# Altium schematic sheet 0057_DISPLAY - DUT EDP .SchDoc
size 848 x 558 mm
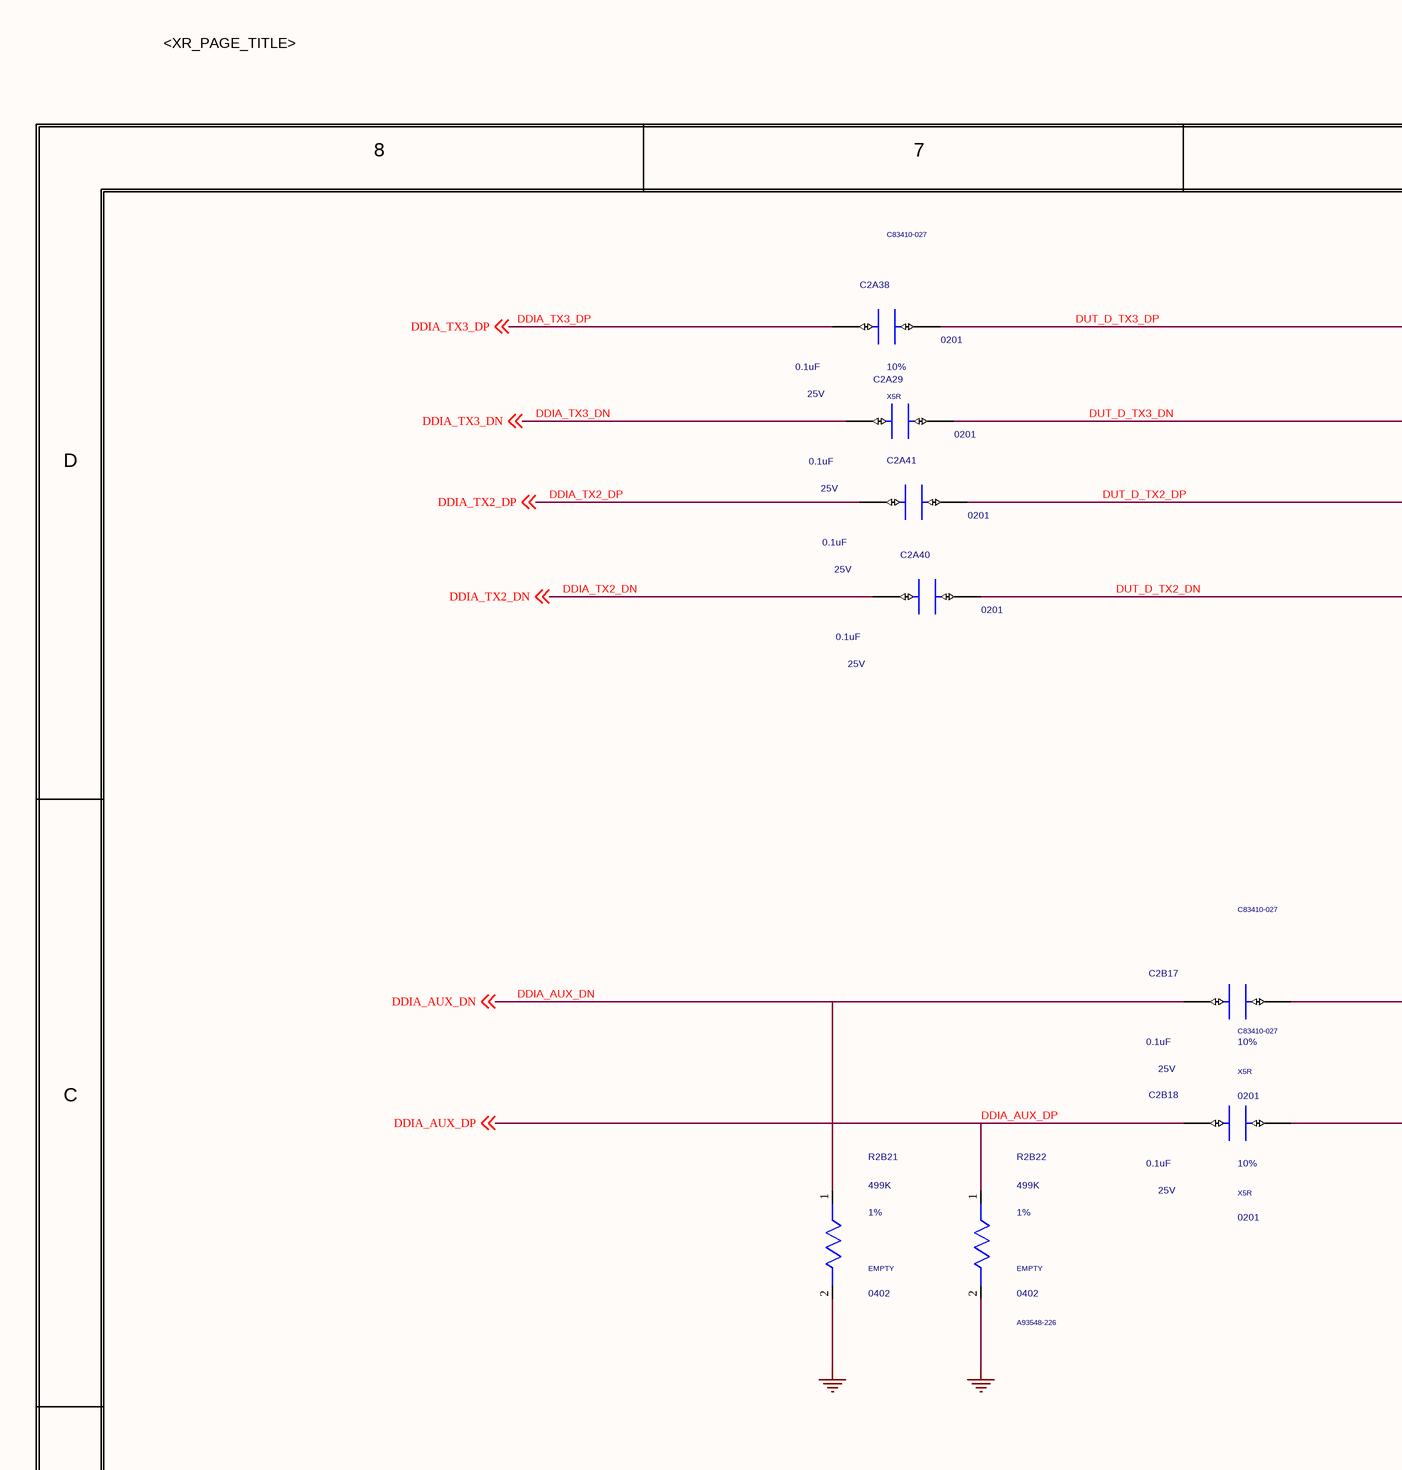
[diagram p0: 0057_DISPLAY - DUT EDP .SchDoc, top left]
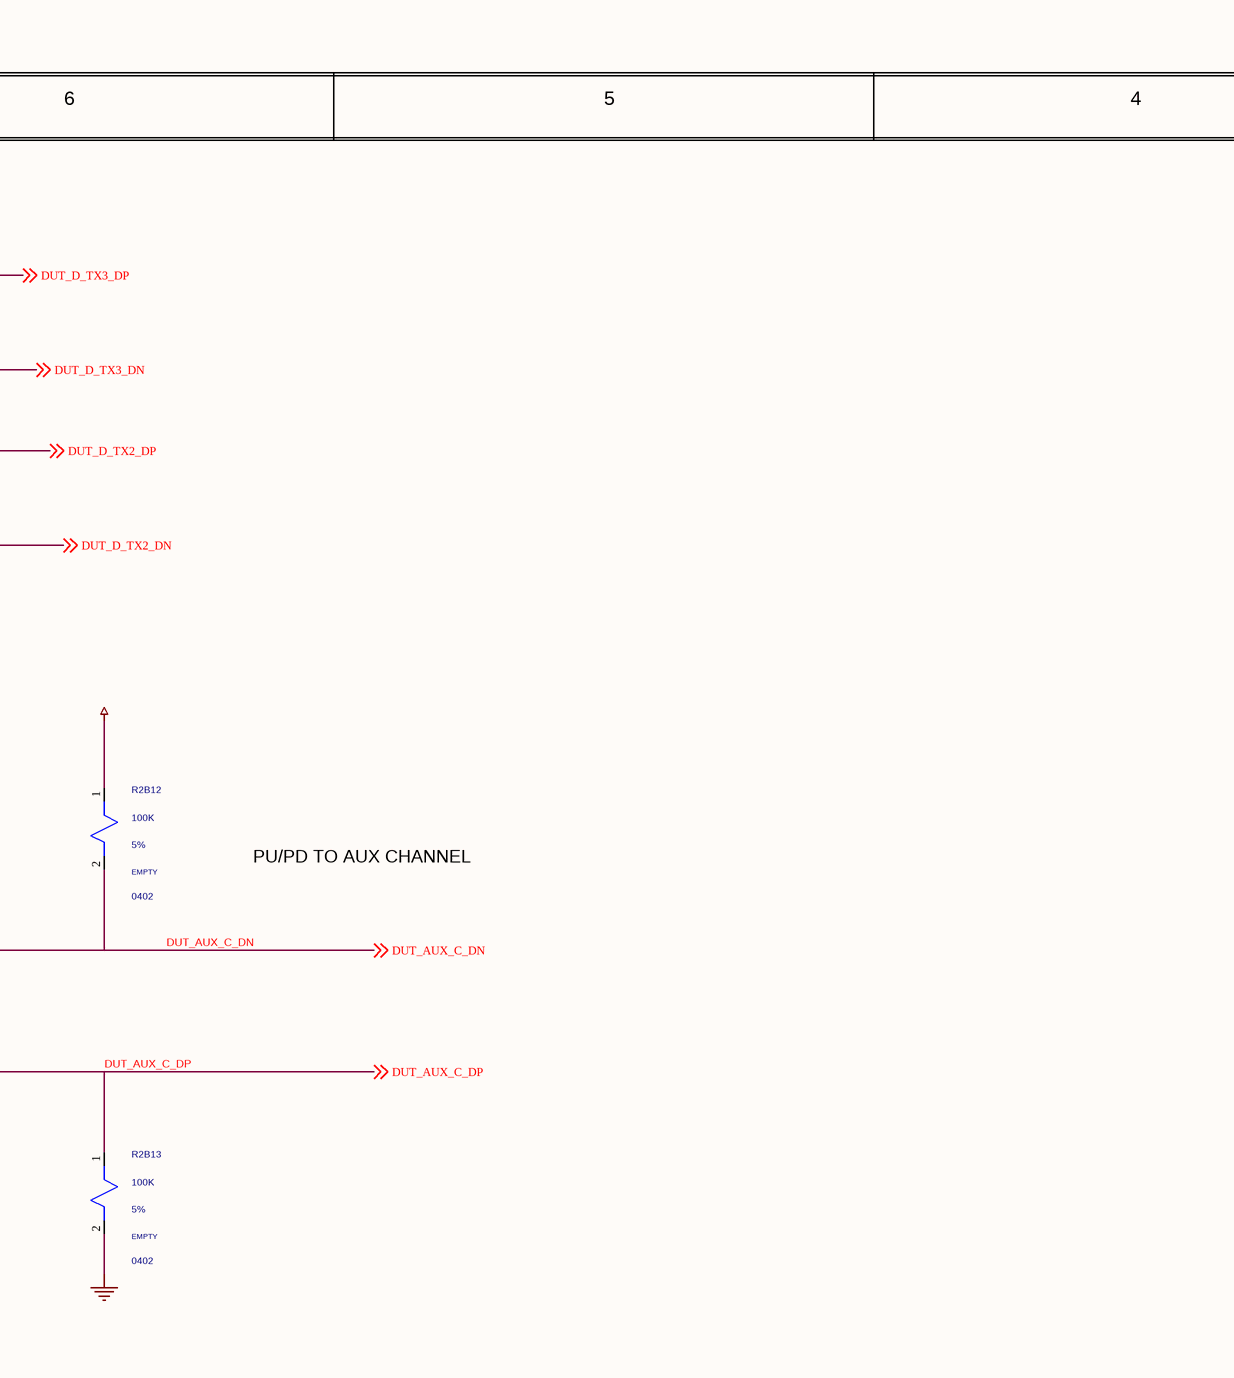
[diagram p1: 0057_DISPLAY - DUT EDP .SchDoc, top middle]
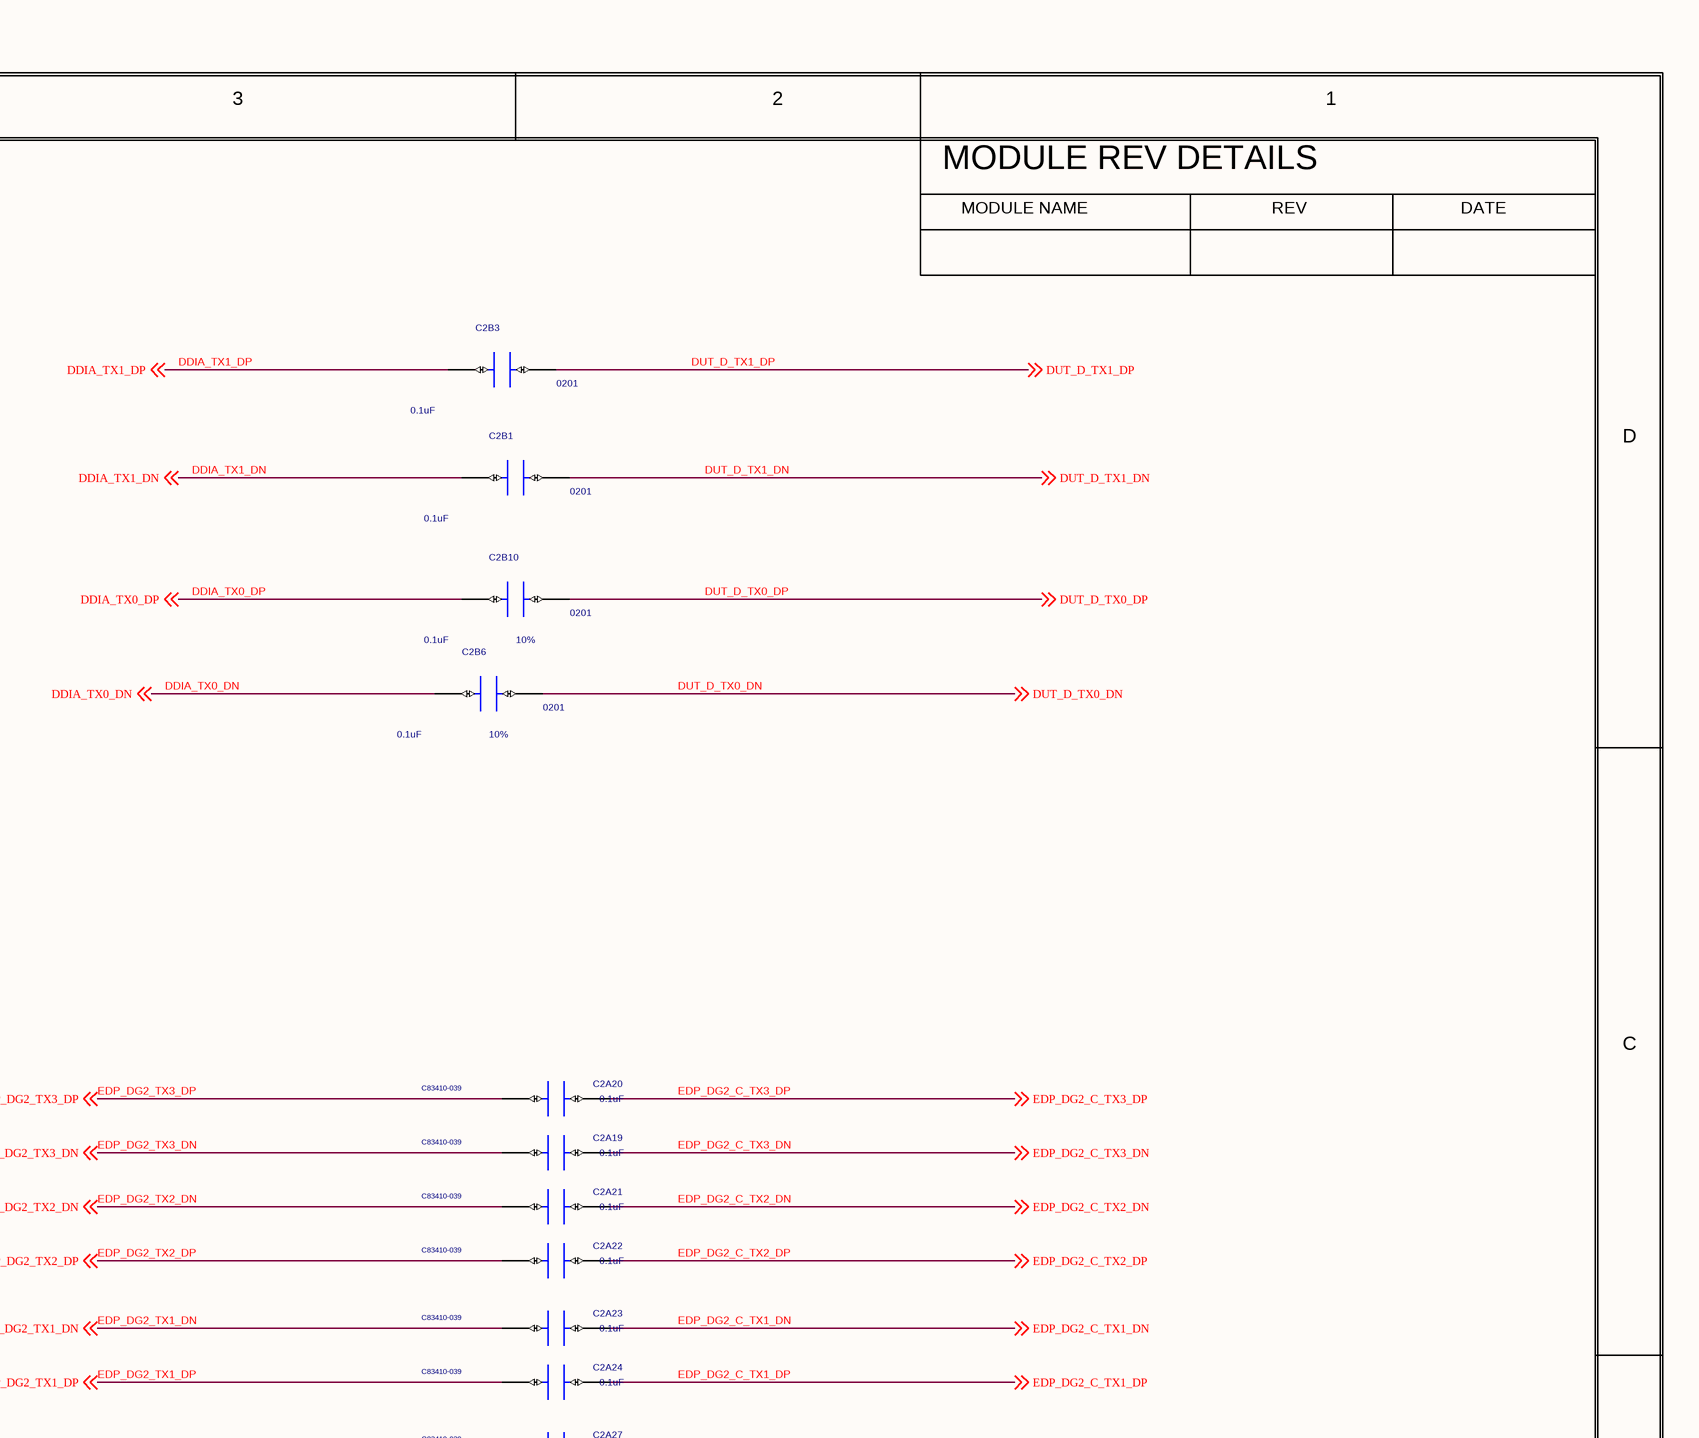
[diagram p2: 0057_DISPLAY - DUT EDP .SchDoc, top right]
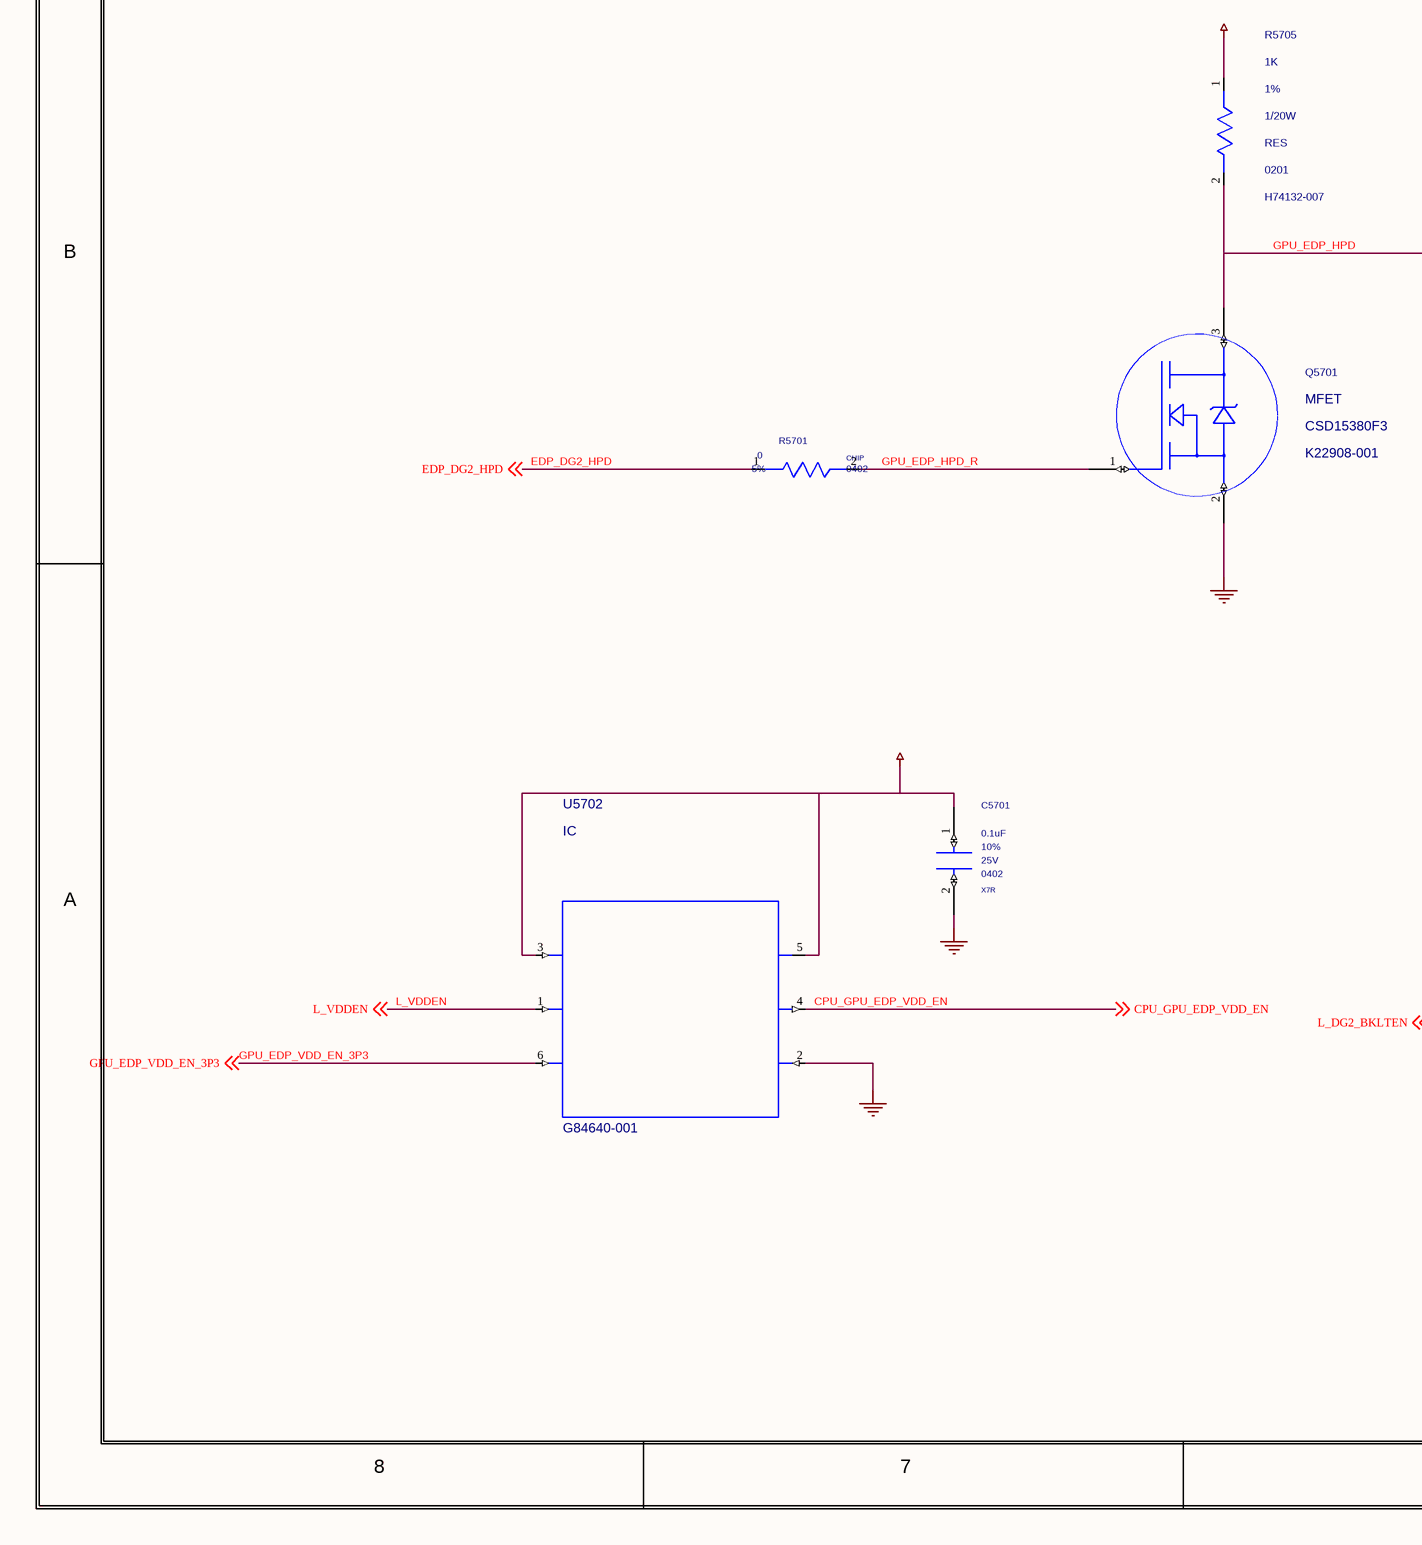
[diagram p3: 0057_DISPLAY - DUT EDP .SchDoc, bottom left]
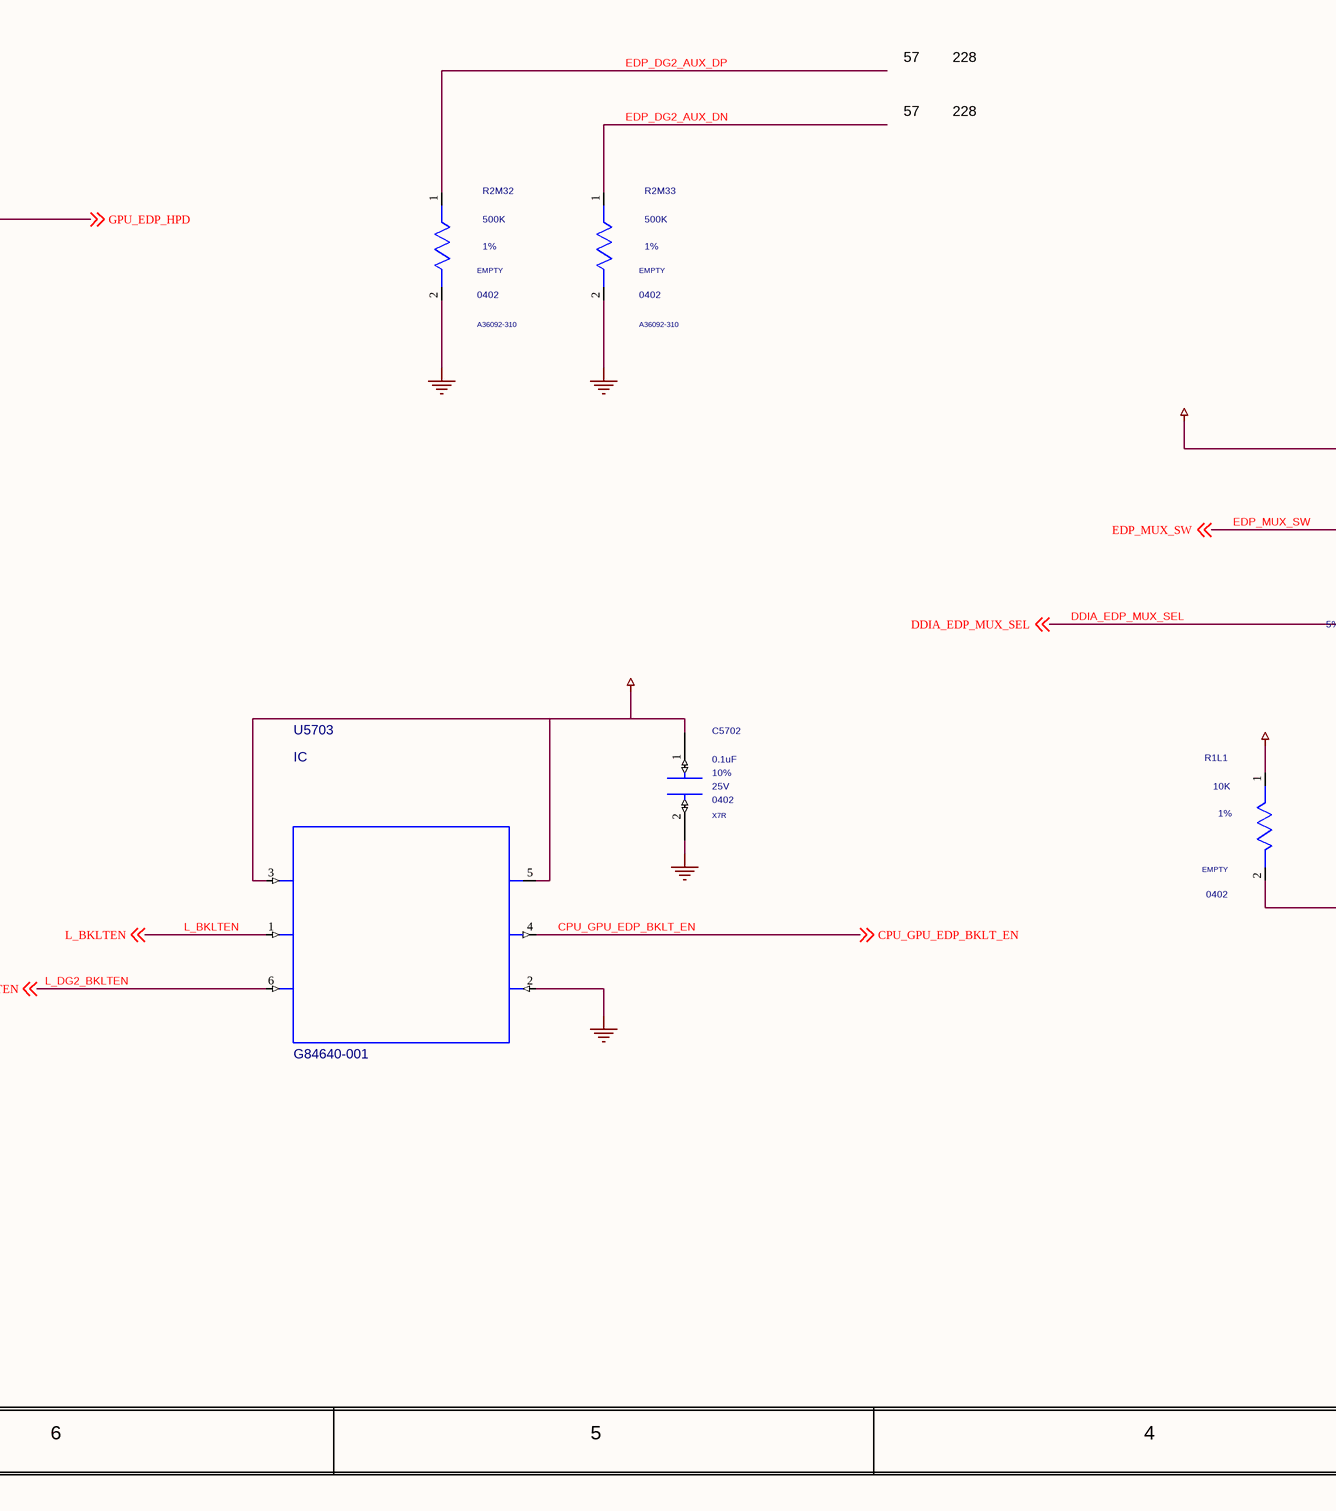
[diagram p4: 0057_DISPLAY - DUT EDP .SchDoc, bottom middle]
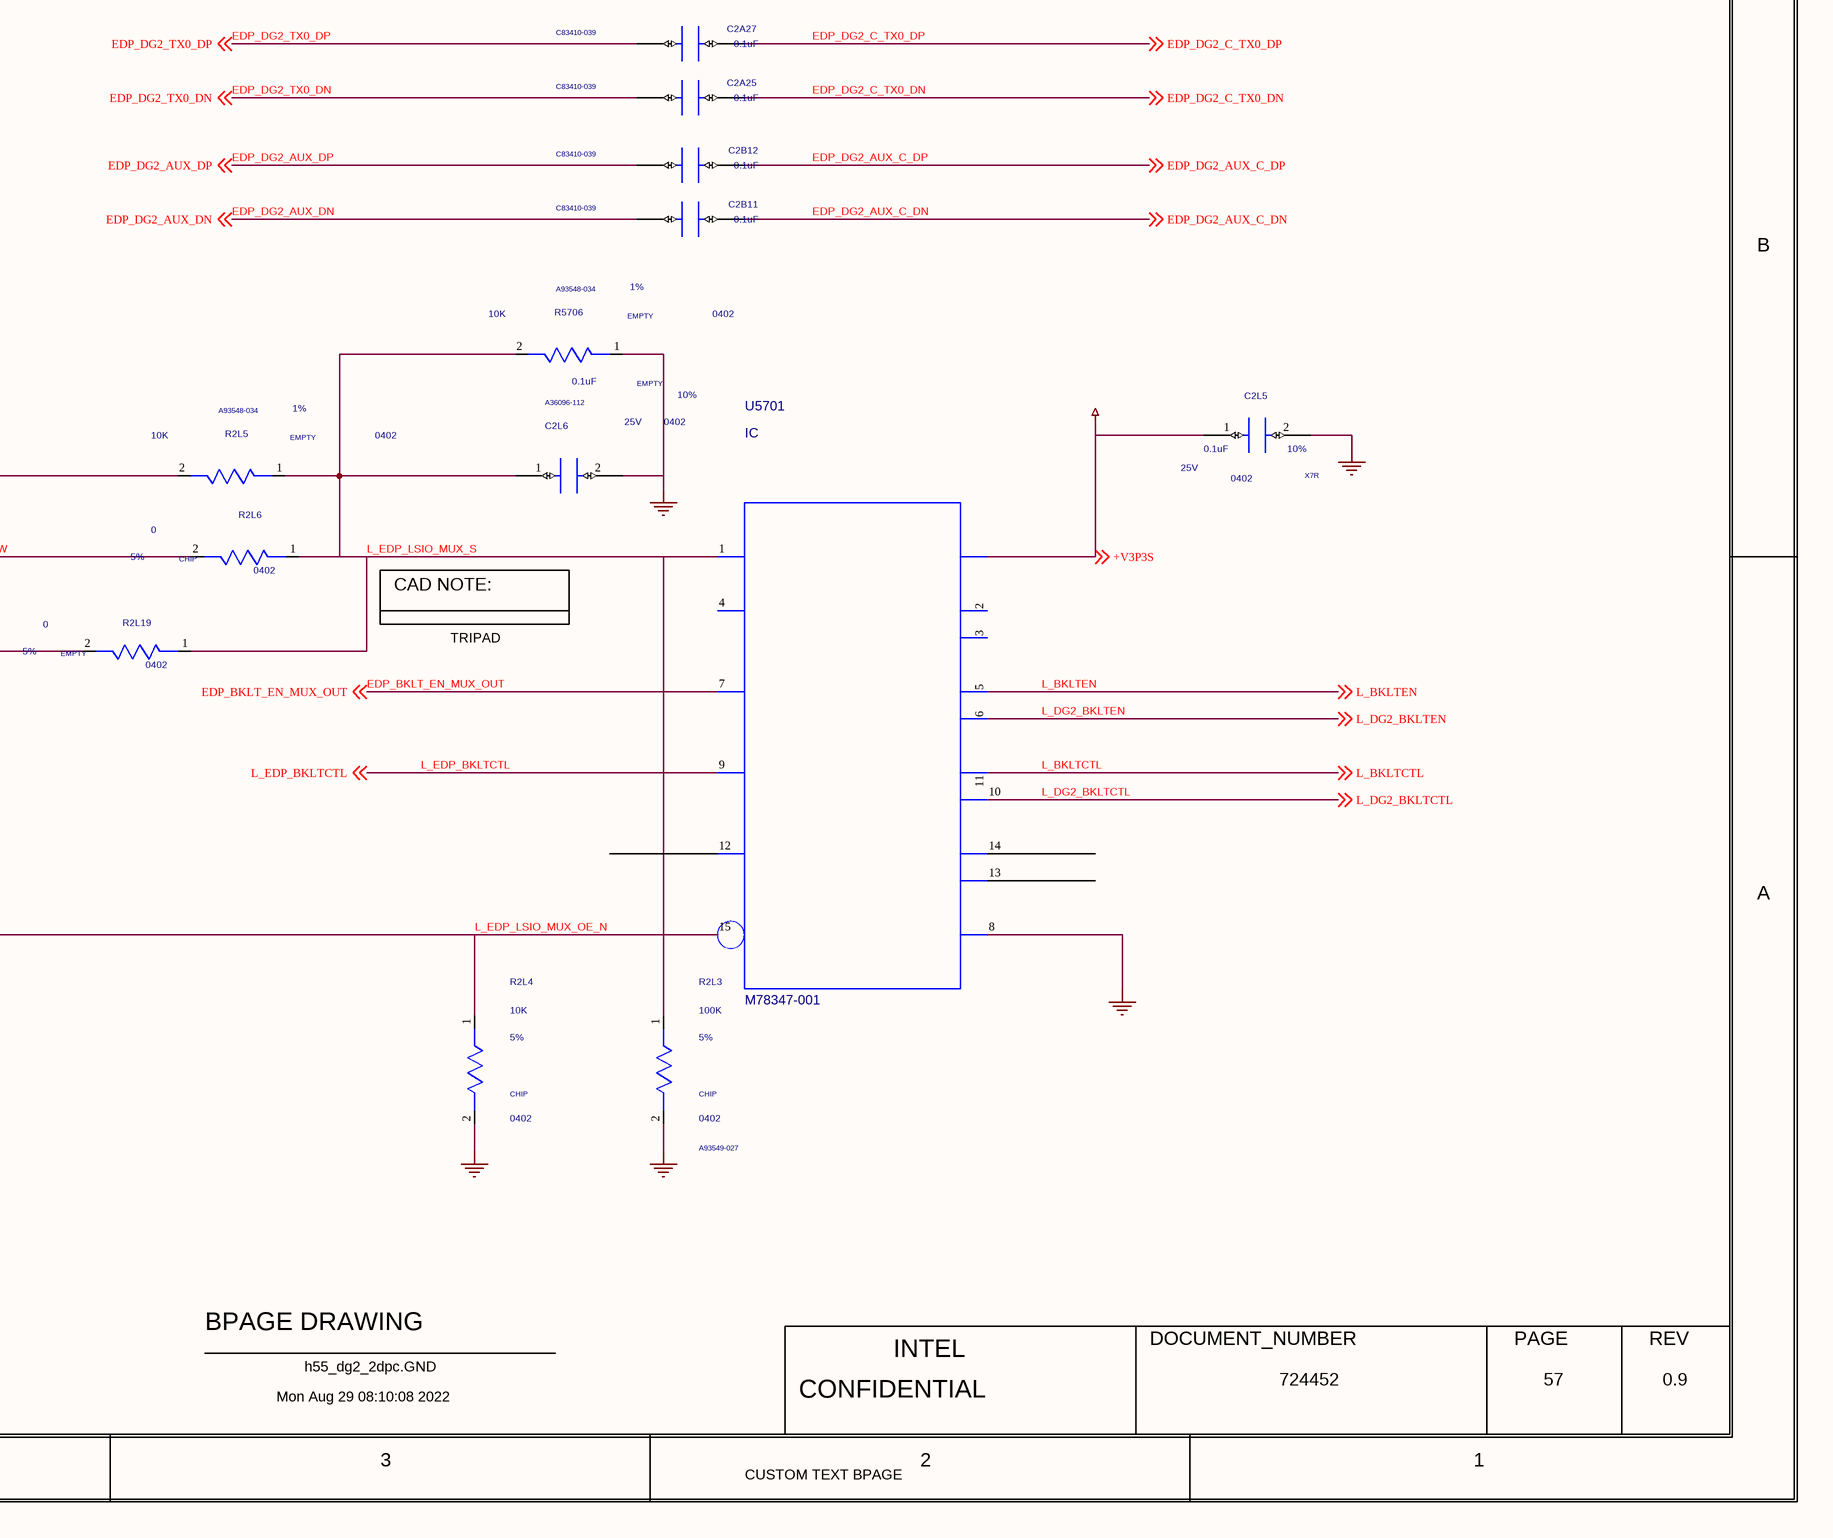
[diagram p5: 0057_DISPLAY - DUT EDP .SchDoc, bottom right]

## Parts
C2A19  0.1uF  PART_NUMBER: C83410-039  [CTK0_SM0201_630X330_MA]
C2A20  0.1uF  PART_NUMBER: C83410-039  [CTK0_SM0201_630X330_MA]
C2A21  0.1uF  PART_NUMBER: C83410-039  [CTK0_SM0201_630X330_MA]
C2A22  0.1uF  PART_NUMBER: C83410-039  [CTK0_SM0201_630X330_MA]
C2A23  0.1uF  PART_NUMBER: C83410-039  [CTK0_SM0201_630X330_MA]
C2A24  0.1uF  PART_NUMBER: C83410-039  [CTK0_SM0201_630X330_MA]
C2A25  0.1uF  PART_NUMBER: C83410-039  [CTK0_SM0201_630X330_MA]
C2A27  0.1uF  PART_NUMBER: C83410-039  [CTK0_SM0201_630X330_MA]
C2A29  0.1uF  PACK_TYPE: 0201  VOLTAGE: 25V  [CTK0_SM0201_650X350_MA]
C2A38  0.1uF  MATERIAL: X5R  PACK_TYPE: 0201  PART_NUMBER: C83410-027  TOLERANCE: 10%  VOLTAGE: 25V  [CTK0_SM0201_650X350_MA]
C2A40  0.1uF  PACK_TYPE: 0201  VOLTAGE: 25V  [CTK0_SM0201_650X350_MA]
C2A41  0.1uF  PACK_TYPE: 0201  VOLTAGE: 25V  [CTK0_SM0201_650X350_MA]
C2B1  0.1uF  PACK_TYPE: 0201  [CTK0_SM0201_650X350_MA]
C2B3  0.1uF  PACK_TYPE: 0201  [CTK0_SM0201_650X350_MA]
C2B6  0.1uF  PACK_TYPE: 0201  TOLERANCE: 10%  [CTK0_SM0201_650X350_MA]
C2B10  0.1uF  PACK_TYPE: 0201  TOLERANCE: 10%  [CTK0_SM0201_650X350_MA]
C2B11  0.1uF  PART_NUMBER: C83410-039  [CTK0_SM0201_630X330_MA]
C2B12  0.1uF  PART_NUMBER: C83410-039  [CTK0_SM0201_630X330_MA]
C2B17  0.1uF  MATERIAL: X5R  PACK_TYPE: 0201  PART_NUMBER: C83410-027  TOLERANCE: 10%  VOLTAGE: 25V  [CTK0_SM0201_650X350_MA]
C2B18  0.1uF  MATERIAL: X5R  PACK_TYPE: 0201  PART_NUMBER: C83410-027  TOLERANCE: 10%  VOLTAGE: 25V  [CTK0_SM0201_650X350_MA]
C2L5  0.1uF  MATERIAL: X7R  PACK_TYPE: 0402  TOLERANCE: 10%  VOLTAGE: 25V  [SMC0402IA]
C2L6  0.1uF  MATERIAL: EMPTY  PACK_TYPE: 0402  PART_NUMBER: A36096-112  TOLERANCE: 10%  VOLTAGE: 25V  [SMC0402IA]
C5701  0.1uF  MATERIAL: X7R  PACK_TYPE: 0402  TOLERANCE: 10%  VOLTAGE: 25V  [SMC0402IA]
C5702  0.1uF  MATERIAL: X7R  PACK_TYPE: 0402  TOLERANCE: 10%  VOLTAGE: 25V  [SMC0402IA]
Q5701  CSD15380F3  MATERIAL: MFET  PART_NUMBER: K22908-001  [TK2_LCC3_730X640_350_MA]
R1L1  10K  MATERIAL: EMPTY  PACK_TYPE: 0402  TOLERANCE: 1%  [SMR0402IA]
R2B12  100K  MATERIAL: EMPTY  PACK_TYPE: 0402  TOLERANCE: 5%  [SMR0402IA]
R2B13  100K  MATERIAL: EMPTY  PACK_TYPE: 0402  TOLERANCE: 5%  [SMR0402IA]
R2B21  499K  MATERIAL: EMPTY  PACK_TYPE: 0402  TOLERANCE: 1%  [SMR0402IA]
R2B22  499K  MATERIAL: EMPTY  PACK_TYPE: 0402  PART_NUMBER: A93548-226  TOLERANCE: 1%  [SMR0402IA]
R2L3  100K  MATERIAL: CHIP  PACK_TYPE: 0402  PART_NUMBER: A93549-027  TOLERANCE: 5%  [SMR0402IA]
R2L4  10K  MATERIAL: CHIP  PACK_TYPE: 0402  TOLERANCE: 5%  [SMR0402IA]
R2L5  10K  MATERIAL: EMPTY  PACK_TYPE: 0402  PART_NUMBER: A93548-034  TOLERANCE: 1%  [SMR0402IA]
R2L6  0  MATERIAL: CHIP  PACK_TYPE: 0402  TOLERANCE: 5%  [SMR0402IA]
R2L19  0  MATERIAL: EMPTY  PACK_TYPE: 0402  TOLERANCE: 5%  [SMR0402IA]
R2M32  500K  MATERIAL: EMPTY  PACK_TYPE: 0402  PART_NUMBER: A36092-310  TOLERANCE: 1%  [SMR0402IA]
R2M33  500K  MATERIAL: EMPTY  PACK_TYPE: 0402  PART_NUMBER: A36092-310  TOLERANCE: 1%  [SMR0402IA]
R5701  0  MATERIAL: CHIP  PACK_TYPE: 0402  TOLERANCE: 5%  [SMR0402IA]
R5705  1K  PACK_TYPE: 0201  PART_NUMBER: H74132-007  TOLERANCE: 1%  WATTAGE: 1/20W  [SMR0201IA]
R5706  10K  MATERIAL: EMPTY  PACK_TYPE: 0402  PART_NUMBER: A93548-034  TOLERANCE: 1%  [SMR0402IA]
U5701  MATERIAL: IC  PART_NUMBER: M78347-001  [CTK2_SSOP16_3980X5000_635_MA]  (hidden comment: C_SN74CBTLV3257)
U5702  MATERIAL: IC  PART_NUMBER: G84640-001  [CTK2_LCC6_S1050_350_MA_MR]  (hidden comment: C_TTL1G97)
U5703  MATERIAL: IC  PART_NUMBER: G84640-001  [CTK2_LCC6_S1050_350_MA_MR]  (hidden comment: C_TTL1G97)

## Nets
+V1P8S: R5705.1(A)
+V3P3S: C2L5.1(A) R1L1.1(A) R2B12.1(A) R2L5.2(B) ; off-sheet +V3P3S
+V3P3U_DPMUX0: C5701.1(A) C5702.1(A) U5702.3(A) U5702.5(VCC) U5703.3(A) U5703.5(VCC)
GND: C2L5.2(B) C2L6.2(B) C5701.2(B) C5702.2(B) Q5701.2(SRC) R2B13.2(B) R2B21.2(B) R2B22.2(B) R2L3.2(B) R2L4.2(B) R2M32.2(B) R2M33.2(B) R5706.1(A) U5701.8(GND) U5702.2(GND) U5703.2(GND)
VCC: U5701.16(VCC)
CPU_GPU_EDP_BKLT_EN: U5703.4(Y) ; off-sheet CPU_GPU_EDP_BKLT_EN
CPU_GPU_EDP_VDD_EN: U5702.4(Y) ; off-sheet CPU_GPU_EDP_VDD_EN
DDIA_AUX_DN: C2B17.1(A) R2B21.1(A) ; off-sheet DDIA_AUX_DN
DDIA_AUX_DP: C2B18.1(A) R2B22.1(A) ; off-sheet DDIA_AUX_DP
DDIA_EDP_MUX_SEL: R2L19.2(B) ; off-sheet DDIA_EDP_MUX_SEL
DDIA_TX0_DN: C2B6.1(A) ; off-sheet DDIA_TX0_DN
DDIA_TX0_DP: C2B10.1(A) ; off-sheet DDIA_TX0_DP
DDIA_TX1_DN: C2B1.1(A) ; off-sheet DDIA_TX1_DN
DDIA_TX1_DP: C2B3.1(A) ; off-sheet DDIA_TX1_DP
DDIA_TX2_DN: C2A40.1(A) ; off-sheet DDIA_TX2_DN
DDIA_TX2_DP: C2A41.1(A) ; off-sheet DDIA_TX2_DP
DDIA_TX3_DN: C2A29.1(A) ; off-sheet DDIA_TX3_DN
DDIA_TX3_DP: C2A38.1(A) ; off-sheet DDIA_TX3_DP
DUT_AUX_C_DN: C2B17.2(B) R2B12.2(B) ; off-sheet DUT_AUX_C_DN
DUT_AUX_C_DP: C2B18.2(B) R2B13.1(A) ; off-sheet DUT_AUX_C_DP
DUT_D_TX0_DN: C2B6.2(B) ; off-sheet DUT_D_TX0_DN
DUT_D_TX0_DP: C2B10.2(B) ; off-sheet DUT_D_TX0_DP
DUT_D_TX1_DN: C2B1.2(B) ; off-sheet DUT_D_TX1_DN
DUT_D_TX1_DP: C2B3.2(B) ; off-sheet DUT_D_TX1_DP
DUT_D_TX2_DN: C2A40.2(B) ; off-sheet DUT_D_TX2_DN
DUT_D_TX2_DP: C2A41.2(B) ; off-sheet DUT_D_TX2_DP
DUT_D_TX3_DN: C2A29.2(B) ; off-sheet DUT_D_TX3_DN
DUT_D_TX3_DP: C2A38.2(B) ; off-sheet DUT_D_TX3_DP
EDP_BKLT_EN_MUX_OUT: U5701.7(2A) ; off-sheet EDP_BKLT_EN_MUX_OUT
EDP_DG2_AUX_C_DN: C2B11.2(B) ; off-sheet EDP_DG2_AUX_C_DN
EDP_DG2_AUX_C_DP: C2B12.2(B) ; off-sheet EDP_DG2_AUX_C_DP
EDP_DG2_AUX_DN: C2B11.1(A) R2M33.1(A) ; off-sheet EDP_DG2_AUX_DN
EDP_DG2_AUX_DP: C2B12.1(A) R2M32.1(A) ; off-sheet EDP_DG2_AUX_DP
EDP_DG2_C_TX0_DN: C2A25.2(B) ; off-sheet EDP_DG2_C_TX0_DN
EDP_DG2_C_TX0_DP: C2A27.2(B) ; off-sheet EDP_DG2_C_TX0_DP
EDP_DG2_C_TX1_DN: C2A23.2(B) ; off-sheet EDP_DG2_C_TX1_DN
EDP_DG2_C_TX1_DP: C2A24.2(B) ; off-sheet EDP_DG2_C_TX1_DP
EDP_DG2_C_TX2_DN: C2A21.2(B) ; off-sheet EDP_DG2_C_TX2_DN
EDP_DG2_C_TX2_DP: C2A22.2(B) ; off-sheet EDP_DG2_C_TX2_DP
EDP_DG2_C_TX3_DN: C2A19.2(B) ; off-sheet EDP_DG2_C_TX3_DN
EDP_DG2_C_TX3_DP: C2A20.2(B) ; off-sheet EDP_DG2_C_TX3_DP
EDP_DG2_HPD: R5701.1(A) ; off-sheet EDP_DG2_HPD
EDP_DG2_TX0_DN: C2A25.1(A) ; off-sheet EDP_DG2_TX0_DN
EDP_DG2_TX0_DP: C2A27.1(A) ; off-sheet EDP_DG2_TX0_DP
EDP_DG2_TX1_DN: C2A23.1(A) ; off-sheet EDP_DG2_TX1_DN
EDP_DG2_TX1_DP: C2A24.1(A) ; off-sheet EDP_DG2_TX1_DP
EDP_DG2_TX2_DN: C2A21.1(A) ; off-sheet EDP_DG2_TX2_DN
EDP_DG2_TX2_DP: C2A22.1(A) ; off-sheet EDP_DG2_TX2_DP
EDP_DG2_TX3_DN: C2A19.1(A) ; off-sheet EDP_DG2_TX3_DN
EDP_DG2_TX3_DP: C2A20.1(A) ; off-sheet EDP_DG2_TX3_DP
EDP_MUX_SW: R2L6.2(B) ; off-sheet EDP_MUX_SW
GPU_EDP_HPD: Q5701.3(DRN) R5705.2(B) ; off-sheet GPU_EDP_HPD
GPU_EDP_HPD_R: Q5701.1(GATE) R5701.2(B)
GPU_EDP_VDD_EN_3P3: U5702.6(C) ; off-sheet GPU_EDP_VDD_EN_3P3
L_BKLTCTL: U5701.11(3B1) ; off-sheet L_BKLTCTL
L_BKLTEN: U5701.5(2B1) U5703.1(B) ; off-sheet L_BKLTEN
L_DG2_BKLTCTL: U5701.10(3B2) ; off-sheet L_DG2_BKLTCTL
L_DG2_BKLTEN: U5701.6(2B2) U5703.6(C) ; off-sheet L_DG2_BKLTEN
L_EDP_BKLTCTL: U5701.9(3A) ; off-sheet L_EDP_BKLTCTL
L_EDP_LSIO_MUX_OE_N: R1L1.2(B) R2L4.1(A) U5701.15(OE_N)
L_EDP_LSIO_MUX_S: C2L6.1(A) R2L3.1(A) R2L5.1(A) R2L6.1(A) R2L19.1(A) R5706.2(B) U5701.1(S)
L_VDDEN: U5702.1(B) ; off-sheet L_VDDEN

Not connected (* = marked no-connect by the designer): U5701 2(1B1) 3(1B2) 4(1A) 12(4A) 13(4B2) 14(4B1)

## Notes on the sheet
- <XR_PAGE_TITLE>
- 8
- 7
- 6
- 5
- 4
- 3
- 2
- 1
- MODULE REV DETAILS
- MODULE NAME
- REV
- DATE
- D
- PU/PD TO AUX CHANNEL
- C
- 57
- 228
- B
- CAD NOTE:
- TRIPAD
- A
- BPAGE DRAWING
- INTEL
- DOCUMENT_NUMBER
- PAGE
- Mon Aug 29 08:10:08 2022
- h55_dg2_2dpc.GND
- CONFIDENTIAL
- 724452
- 0.9
- CUSTOM TEXT BPAGE

## Library data of the parts
C2A19 = C_CAP#1: CHIPS_PART_NAME: C_CAP; CDS_PHYS_PART_NAME: C_CAP_0201-C83410-039,X5R,0.1UF,25V,20%,TK0,GENERIC; CDS_LMAN_SYM_OUTLINE: -50,50,50,-50; FP_TECH: TK0; IP: GENERIC; MATERIAL: X5R; PACK_TYPE: 0201; ROOM: NONE; TOLERANCE: 20%; VOLTAGE: 25V; OriginalSymbolOrigin: (-25,50); XY: (7850,3125); VER: 2; ROT: 0; PHYS_PAGE: 57; LOCATION: C2A19; FIN: EDP; DRAWING: @RVP1_ADL_SB_ADP_S_DDR5_SODIMM_2DPC_LIB.H55_DG2_2DPC(SCH_1):PAGE57; CDS_LIB: c_discrete; BOM: HDMI; VARIANT: ?; PCB Footprint: CTK0_SM0201_630X330_MA; SEC_TYPE: 0201; CDS_PART_NAME: C_CAP_0201-C83410-039,X5R,0.1UF,25V,20%,TK0,GENERIC; CDS_LOCATION: C2A19; ASI_MODEL: C83410-039
C2A20 = C_CAP#1: CHIPS_PART_NAME: C_CAP; CDS_PHYS_PART_NAME: C_CAP_0201-C83410-039,X5R,0.1UF,25V,20%,TK0,GENERIC; CDS_LMAN_SYM_OUTLINE: -50,50,50,-50; FP_TECH: TK0; IP: GENERIC; MATERIAL: X5R; PACK_TYPE: 0201; ROOM: NONE; TOLERANCE: 20%; VOLTAGE: 25V; OriginalSymbolOrigin: (-25,50); XY: (7850,3225); VER: 2; ROT: 0; PHYS_PAGE: 57; LOCATION: C2A20; FIN: EDP; DRAWING: @RVP1_ADL_SB_ADP_S_DDR5_SODIMM_2DPC_LIB.H55_DG2_2DPC(SCH_1):PAGE57; CDS_LIB: c_discrete; BOM: HDMI; VARIANT: ?; PCB Footprint: CTK0_SM0201_630X330_MA; SEC_TYPE: 0201; CDS_PART_NAME: C_CAP_0201-C83410-039,X5R,0.1UF,25V,20%,TK0,GENERIC; CDS_LOCATION: C2A20; ASI_MODEL: C83410-039
C2A21 = C_CAP#1: CHIPS_PART_NAME: C_CAP; CDS_PHYS_PART_NAME: C_CAP_0201-C83410-039,X5R,0.1UF,25V,20%,TK0,GENERIC; CDS_LMAN_SYM_OUTLINE: -50,50,50,-50; FP_TECH: TK0; IP: GENERIC; MATERIAL: X5R; PACK_TYPE: 0201; ROOM: NONE; TOLERANCE: 20%; VOLTAGE: 25V; OriginalSymbolOrigin: (-25,50); XY: (7850,3025); VER: 2; ROT: 0; PHYS_PAGE: 57; LOCATION: C2A21; FIN: EDP; DRAWING: @RVP1_ADL_SB_ADP_S_DDR5_SODIMM_2DPC_LIB.H55_DG2_2DPC(SCH_1):PAGE57; CDS_LIB: c_discrete; BOM: HDMI; VARIANT: ?; PCB Footprint: CTK0_SM0201_630X330_MA; SEC_TYPE: 0201; CDS_PART_NAME: C_CAP_0201-C83410-039,X5R,0.1UF,25V,20%,TK0,GENERIC; CDS_LOCATION: C2A21; ASI_MODEL: C83410-039
C2A22 = C_CAP#1: CHIPS_PART_NAME: C_CAP; CDS_PHYS_PART_NAME: C_CAP_0201-C83410-039,X5R,0.1UF,25V,20%,TK0,GENERIC; CDS_LMAN_SYM_OUTLINE: -50,50,50,-50; FP_TECH: TK0; IP: GENERIC; MATERIAL: X5R; PACK_TYPE: 0201; ROOM: NONE; TOLERANCE: 20%; VOLTAGE: 25V; OriginalSymbolOrigin: (-25,50); XY: (7850,2925); VER: 2; ROT: 0; PHYS_PAGE: 57; LOCATION: C2A22; FIN: EDP; DRAWING: @RVP1_ADL_SB_ADP_S_DDR5_SODIMM_2DPC_LIB.H55_DG2_2DPC(SCH_1):PAGE57; CDS_LIB: c_discrete; BOM: HDMI; VARIANT: ?; PCB Footprint: CTK0_SM0201_630X330_MA; SEC_TYPE: 0201; CDS_PART_NAME: C_CAP_0201-C83410-039,X5R,0.1UF,25V,20%,TK0,GENERIC; CDS_LOCATION: C2A22; ASI_MODEL: C83410-039
C2A23 = C_CAP#1: CHIPS_PART_NAME: C_CAP; CDS_PHYS_PART_NAME: C_CAP_0201-C83410-039,X5R,0.1UF,25V,20%,TK0,GENERIC; CDS_LMAN_SYM_OUTLINE: -50,50,50,-50; FP_TECH: TK0; IP: GENERIC; MATERIAL: X5R; PACK_TYPE: 0201; ROOM: NONE; TOLERANCE: 20%; VOLTAGE: 25V; OriginalSymbolOrigin: (-25,50); XY: (7850,2800); VER: 2; ROT: 0; PHYS_PAGE: 57; LOCATION: C2A23; FIN: EDP; DRAWING: @RVP1_ADL_SB_ADP_S_DDR5_SODIMM_2DPC_LIB.H55_DG2_2DPC(SCH_1):PAGE57; CDS_LIB: c_discrete; BOM: HDMI; VARIANT: ?; PCB Footprint: CTK0_SM0201_630X330_MA; SEC_TYPE: 0201; CDS_PART_NAME: C_CAP_0201-C83410-039,X5R,0.1UF,25V,20%,TK0,GENERIC; CDS_LOCATION: C2A23; ASI_MODEL: C83410-039
C2A24 = C_CAP#1: CHIPS_PART_NAME: C_CAP; CDS_PHYS_PART_NAME: C_CAP_0201-C83410-039,X5R,0.1UF,25V,20%,TK0,GENERIC; CDS_LMAN_SYM_OUTLINE: -50,50,50,-50; FP_TECH: TK0; IP: GENERIC; MATERIAL: X5R; PACK_TYPE: 0201; ROOM: NONE; TOLERANCE: 20%; VOLTAGE: 25V; OriginalSymbolOrigin: (-25,50); XY: (7850,2700); VER: 2; ROT: 0; PHYS_PAGE: 57; LOCATION: C2A24; FIN: EDP; DRAWING: @RVP1_ADL_SB_ADP_S_DDR5_SODIMM_2DPC_LIB.H55_DG2_2DPC(SCH_1):PAGE57; CDS_LIB: c_discrete; BOM: HDMI; VARIANT: ?; PCB Footprint: CTK0_SM0201_630X330_MA; SEC_TYPE: 0201; CDS_PART_NAME: C_CAP_0201-C83410-039,X5R,0.1UF,25V,20%,TK0,GENERIC; CDS_LOCATION: C2A24; ASI_MODEL: C83410-039
C2A25 = C_CAP#1: CHIPS_PART_NAME: C_CAP; CDS_PHYS_PART_NAME: C_CAP_0201-C83410-039,X5R,0.1UF,25V,20%,TK0,GENERIC; CDS_LMAN_SYM_OUTLINE: -50,50,50,-50; FP_TECH: TK0; IP: GENERIC; MATERIAL: X5R; PACK_TYPE: 0201; ROOM: NONE; TOLERANCE: 20%; VOLTAGE: 25V; OriginalSymbolOrigin: (-25,50); XY: (7850,2475); VER: 2; ROT: 0; PHYS_PAGE: 57; LOCATION: C2A25; FIN: EDP; DRAWING: @RVP1_ADL_SB_ADP_S_DDR5_SODIMM_2DPC_LIB.H55_DG2_2DPC(SCH_1):PAGE57; CDS_LIB: c_discrete; BOM: HDMI; VARIANT: ?; PCB Footprint: CTK0_SM0201_630X330_MA; SEC_TYPE: 0201; CDS_PART_NAME: C_CAP_0201-C83410-039,X5R,0.1UF,25V,20%,TK0,GENERIC; CDS_LOCATION: C2A25; ASI_MODEL: C83410-039
C2A27 = C_CAP#1: CHIPS_PART_NAME: C_CAP; CDS_PHYS_PART_NAME: C_CAP_0201-C83410-039,X5R,0.1UF,25V,20%,TK0,GENERIC; CDS_LMAN_SYM_OUTLINE: -50,50,50,-50; FP_TECH: TK0; IP: GENERIC; MATERIAL: X5R; PACK_TYPE: 0201; ROOM: NONE; TOLERANCE: 20%; VOLTAGE: 25V; OriginalSymbolOrigin: (-25,50); XY: (7850,2575); VER: 2; ROT: 0; PHYS_PAGE: 57; LOCATION: C2A27; FIN: EDP; DRAWING: @RVP1_ADL_SB_ADP_S_DDR5_SODIMM_2DPC_LIB.H55_DG2_2DPC(SCH_1):PAGE57; CDS_LIB: c_discrete; BOM: HDMI; VARIANT: ?; PCB Footprint: CTK0_SM0201_630X330_MA; SEC_TYPE: 0201; CDS_PART_NAME: C_CAP_0201-C83410-039,X5R,0.1UF,25V,20%,TK0,GENERIC; CDS_LOCATION: C2A27; ASI_MODEL: C83410-039
C2A29 = C_CAP#1: PART_NUMBER: C83410-027; CHIPS_PART_NAME: C_CAP; CDS_PHYS_PART_NAME: C_CAP_0201-C83410-027,X5R,0.1UF,25V,10%,TK0,GENERIC; CDS_LMAN_SYM_OUTLINE: -50,50,50,-50; FP_TECH: TK0; IP: GENERIC; MATERIAL: X5R; ROOM: NONE; TOLERANCE: 10%; OriginalSymbolOrigin: (-25,50); XY: (3250,4575); VER: 2; ROT: 0; PHYS_PAGE: 57; LOCATION: C2A29; FIN: EDP; DRAWING: @RVP1_ADL_SB_ADP_S_DDR5_SODIMM_2DPC_LIB.H55_DG2_2DPC(SCH_1):PAGE57; CDS_LIB: c_discrete; BOM: HDMI; VARIANT: ?; PCB Footprint: CTK0_SM0201_650X350_MA; CDS_PART_NAME: C_CAP_0201-C83410-027,X5R,0.1UF,25V,10%,TK0,GENERIC; CDS_LOCATION: C2A29; ASI_MODEL: C83410-027
C2A38 = C_CAP#1: CHIPS_PART_NAME: C_CAP; CDS_PHYS_PART_NAME: C_CAP_0201-C83410-027,X5R,0.1UF,25V,10%,TK0,GENERIC; CDS_LMAN_SYM_OUTLINE: -50,50,50,-50; FP_TECH: TK0; IP: GENERIC; ROOM: NONE; OriginalSymbolOrigin: (-25,50); XY: (3225,4750); VER: 2; ROT: 0; PHYS_PAGE: 57; LOCATION: C2A38; FIN: EDP; DRAWING: @RVP1_ADL_SB_ADP_S_DDR5_SODIMM_2DPC_LIB.H55_DG2_2DPC(SCH_1):PAGE57; CDS_LIB: c_discrete; BOM: HDMI; VARIANT: ?; PCB Footprint: CTK0_SM0201_650X350_MA; CDS_PART_NAME: C_CAP_0201-C83410-027,X5R,0.1UF,25V,10%,TK0,GENERIC; CDS_LOCATION: C2A38; ASI_MODEL: C83410-027
C2A40 = C_CAP#1: PART_NUMBER: C83410-027; CHIPS_PART_NAME: C_CAP; CDS_PHYS_PART_NAME: C_CAP_0201-C83410-027,X5R,0.1UF,25V,10%,TK0,GENERIC; CDS_LMAN_SYM_OUTLINE: -50,50,50,-50; FP_TECH: TK0; IP: GENERIC; MATERIAL: X5R; ROOM: NONE; TOLERANCE: 10%; OriginalSymbolOrigin: (-25,50); XY: (3300,4250); VER: 2; ROT: 0; PHYS_PAGE: 57; LOCATION: C2A40; FIN: EDP; DRAWING: @RVP1_ADL_SB_ADP_S_DDR5_SODIMM_2DPC_LIB.H55_DG2_2DPC(SCH_1):PAGE57; CDS_LIB: c_discrete; BOM: HDMI; VARIANT: ?; PCB Footprint: CTK0_SM0201_650X350_MA; CDS_PART_NAME: C_CAP_0201-C83410-027,X5R,0.1UF,25V,10%,TK0,GENERIC; CDS_LOCATION: C2A40; ASI_MODEL: C83410-027
C2A41 = C_CAP#1: PART_NUMBER: C83410-027; CHIPS_PART_NAME: C_CAP; CDS_PHYS_PART_NAME: C_CAP_0201-C83410-027,X5R,0.1UF,25V,10%,TK0,GENERIC; CDS_LMAN_SYM_OUTLINE: -50,50,50,-50; FP_TECH: TK0; IP: GENERIC; MATERIAL: X5R; ROOM: NONE; TOLERANCE: 10%; OriginalSymbolOrigin: (-25,50); XY: (3275,4425); VER: 2; ROT: 0; PHYS_PAGE: 57; LOCATION: C2A41; FIN: EDP; DRAWING: @RVP1_ADL_SB_ADP_S_DDR5_SODIMM_2DPC_LIB.H55_DG2_2DPC(SCH_1):PAGE57; CDS_LIB: c_discrete; BOM: HDMI; VARIANT: ?; PCB Footprint: CTK0_SM0201_650X350_MA; CDS_PART_NAME: C_CAP_0201-C83410-027,X5R,0.1UF,25V,10%,TK0,GENERIC; CDS_LOCATION: C2A41; ASI_MODEL: C83410-027
C2B1 = C_CAP#1: PART_NUMBER: C83410-027; CHIPS_PART_NAME: C_CAP; CDS_PHYS_PART_NAME: C_CAP_0201-C83410-027,X5R,0.1UF,25V,10%,TK0,GENERIC; CDS_LMAN_SYM_OUTLINE: -50,50,50,-50; FP_TECH: TK0; IP: GENERIC; MATERIAL: X5R; ROOM: NONE; TOLERANCE: 10%; VOLTAGE: 25V; OriginalSymbolOrigin: (-25,50); XY: (7775,4375); VER: 2; ROT: 0; PHYS_PAGE: 57; LOCATION: C2B1; FIN: EDP; DRAWING: @RVP1_ADL_SB_ADP_S_DDR5_SODIMM_2DPC_LIB.H55_DG2_2DPC(SCH_1):PAGE57; CDS_LIB: c_discrete; BOM: HDMI; VARIANT: ?; PCB Footprint: CTK0_SM0201_650X350_MA; CDS_PART_NAME: C_CAP_0201-C83410-027,X5R,0.1UF,25V,10%,TK0,GENERIC; CDS_LOCATION: C2B1; ASI_MODEL: C83410-027
C2B3 = C_CAP#1: PART_NUMBER: C83410-027; CHIPS_PART_NAME: C_CAP; CDS_PHYS_PART_NAME: C_CAP_0201-C83410-027,X5R,0.1UF,25V,10%,TK0,GENERIC; CDS_LMAN_SYM_OUTLINE: -50,50,50,-50; FP_TECH: TK0; IP: GENERIC; MATERIAL: X5R; ROOM: NONE; TOLERANCE: 10%; VOLTAGE: 25V; OriginalSymbolOrigin: (-25,50); XY: (7750,4575); VER: 2; ROT: 0; PHYS_PAGE: 57; LOCATION: C2B3; FIN: EDP; DRAWING: @RVP1_ADL_SB_ADP_S_DDR5_SODIMM_2DPC_LIB.H55_DG2_2DPC(SCH_1):PAGE57; CDS_LIB: c_discrete; BOM: HDMI; VARIANT: ?; PCB Footprint: CTK0_SM0201_650X350_MA; CDS_PART_NAME: C_CAP_0201-C83410-027,X5R,0.1UF,25V,10%,TK0,GENERIC; CDS_LOCATION: C2B3; ASI_MODEL: C83410-027
C2B6 = C_CAP#1: PART_NUMBER: C83410-027; CHIPS_PART_NAME: C_CAP; CDS_PHYS_PART_NAME: C_CAP_0201-C83410-027,X5R,0.1UF,25V,10%,TK0,GENERIC; CDS_LMAN_SYM_OUTLINE: -50,50,50,-50; FP_TECH: TK0; IP: GENERIC; MATERIAL: X5R; ROOM: NONE; VOLTAGE: 25V; OriginalSymbolOrigin: (-25,50); XY: (7725,3975); VER: 2; ROT: 0; PHYS_PAGE: 57; LOCATION: C2B6; FIN: EDP; DRAWING: @RVP1_ADL_SB_ADP_S_DDR5_SODIMM_2DPC_LIB.H55_DG2_2DPC(SCH_1):PAGE57; CDS_LIB: c_discrete; BOM: HDMI; VARIANT: ?; PCB Footprint: CTK0_SM0201_650X350_MA; CDS_PART_NAME: C_CAP_0201-C83410-027,X5R,0.1UF,25V,10%,TK0,GENERIC; CDS_LOCATION: C2B6; ASI_MODEL: C83410-027
C2B10 = C_CAP#1: PART_NUMBER: C83410-027; CHIPS_PART_NAME: C_CAP; CDS_PHYS_PART_NAME: C_CAP_0201-C83410-027,X5R,0.1UF,25V,10%,TK0,GENERIC; CDS_LMAN_SYM_OUTLINE: -50,50,50,-50; FP_TECH: TK0; IP: GENERIC; MATERIAL: X5R; ROOM: NONE; VOLTAGE: 25V; OriginalSymbolOrigin: (-25,50); XY: (7775,4150); VER: 2; ROT: 0; PHYS_PAGE: 57; LOCATION: C2B10; FIN: EDP; DRAWING: @RVP1_ADL_SB_ADP_S_DDR5_SODIMM_2DPC_LIB.H55_DG2_2DPC(SCH_1):PAGE57; CDS_LIB: c_discrete; BOM: HDMI; VARIANT: ?; PCB Footprint: CTK0_SM0201_650X350_MA; CDS_PART_NAME: C_CAP_0201-C83410-027,X5R,0.1UF,25V,10%,TK0,GENERIC; CDS_LOCATION: C2B10; ASI_MODEL: C83410-027
C2B11 = C_CAP#1: CHIPS_PART_NAME: C_CAP; CDS_PHYS_PART_NAME: C_CAP_0201-C83410-039,X5R,0.1UF,25V,20%,TK0,GENERIC; CDS_LMAN_SYM_OUTLINE: -50,50,50,-50; FP_TECH: TK0; IP: GENERIC; MATERIAL: X5R; PACK_TYPE: 0201; ROOM: NONE; TOLERANCE: 20%; VOLTAGE: 25V; OriginalSymbolOrigin: (-25,50); XY: (7850,2250); VER: 2; ROT: 0; PHYS_PAGE: 57; LOCATION: C2B11; FIN: EDP; DRAWING: @RVP1_ADL_SB_ADP_S_DDR5_SODIMM_2DPC_LIB.H55_DG2_2DPC(SCH_1):PAGE57; CDS_LIB: c_discrete; BOM: HDMI; VARIANT: ?; PCB Footprint: CTK0_SM0201_630X330_MA; SEC_TYPE: 0201; CDS_PART_NAME: C_CAP_0201-C83410-039,X5R,0.1UF,25V,20%,TK0,GENERIC; CDS_LOCATION: C2B11; ASI_MODEL: C83410-039
C2B12 = C_CAP#1: CHIPS_PART_NAME: C_CAP; CDS_PHYS_PART_NAME: C_CAP_0201-C83410-039,X5R,0.1UF,25V,20%,TK0,GENERIC; CDS_LMAN_SYM_OUTLINE: -50,50,50,-50; FP_TECH: TK0; IP: GENERIC; MATERIAL: X5R; PACK_TYPE: 0201; ROOM: NONE; TOLERANCE: 20%; VOLTAGE: 25V; OriginalSymbolOrigin: (-25,50); XY: (7850,2350); VER: 2; ROT: 0; PHYS_PAGE: 57; LOCATION: C2B12; FIN: EDP; DRAWING: @RVP1_ADL_SB_ADP_S_DDR5_SODIMM_2DPC_LIB.H55_DG2_2DPC(SCH_1):PAGE57; CDS_LIB: c_discrete; BOM: HDMI; VARIANT: ?; PCB Footprint: CTK0_SM0201_630X330_MA; SEC_TYPE: 0201; CDS_PART_NAME: C_CAP_0201-C83410-039,X5R,0.1UF,25V,20%,TK0,GENERIC; CDS_LOCATION: C2B12; ASI_MODEL: C83410-039
C2B17 = C_CAP#1: CHIPS_PART_NAME: C_CAP; CDS_PHYS_PART_NAME: C_CAP_0201-C83410-027,X5R,0.1UF,25V,10%,TK0,GENERIC; CDS_LMAN_SYM_OUTLINE: -50,50,50,-50; FP_TECH: TK0; IP: GENERIC; ROOM: NONE; OriginalSymbolOrigin: (-25,50); XY: (3875,3500); VER: 2; ROT: 0; PHYS_PAGE: 57; LOCATION: C2B17; FIN: EDP; DRAWING: @RVP1_ADL_SB_ADP_S_DDR5_SODIMM_2DPC_LIB.H55_DG2_2DPC(SCH_1):PAGE57; CDS_LIB: c_discrete; BOM: HDMI; VARIANT: ?; PCB Footprint: CTK0_SM0201_650X350_MA; CDS_PART_NAME: C_CAP_0201-C83410-027,X5R,0.1UF,25V,10%,TK0,GENERIC; CDS_LOCATION: C2B17; ASI_MODEL: C83410-027
C2B18 = C_CAP#1: CHIPS_PART_NAME: C_CAP; CDS_PHYS_PART_NAME: C_CAP_0201-C83410-027,X5R,0.1UF,25V,10%,TK0,GENERIC; CDS_LMAN_SYM_OUTLINE: -50,50,50,-50; FP_TECH: TK0; IP: GENERIC; ROOM: NONE; OriginalSymbolOrigin: (-25,50); XY: (3875,3275); VER: 2; ROT: 0; PHYS_PAGE: 57; LOCATION: C2B18; FIN: EDP; DRAWING: @RVP1_ADL_SB_ADP_S_DDR5_SODIMM_2DPC_LIB.H55_DG2_2DPC(SCH_1):PAGE57; CDS_LIB: c_discrete; BOM: HDMI; VARIANT: ?; PCB Footprint: CTK0_SM0201_650X350_MA; CDS_PART_NAME: C_CAP_0201-C83410-027,X5R,0.1UF,25V,10%,TK0,GENERIC; CDS_LOCATION: C2B18; ASI_MODEL: C83410-027
C2L5 = CAP#1: PART_NUMBER: A36096-112; CHIPS_PART_NAME: CAP; CDS_PHYS_PART_NAME: CAP_0402-A36096-112,X7R,0.1UF,25V,10%,LPDB,GENERIC; OriginalSymbolOrigin: (-25,50); XY: (8900,1850); VER: 2; ROT: 0; ROOM: DCL_PCIX; PHYS_PAGE: 57; LOCATION: C2L5; FIN: EDP; DRAWING: @RVP1_ADL_SB_ADP_S_DDR5_SODIMM_2DPC_LIB.H55_DG2_2DPC(SCH_1):PAGE57; CDS_LIB: discrete; BOM: HDMI; PCB Footprint: SMC0402IA; CDS_PART_NAME: CAP_0402-A36096-112,X7R,0.1UF,25V,10%,LPDB,GENERIC; CDS_LOCATION: C2L5; ASI_MODEL: A36096-112
C2L6 = CAP#1: CHIPS_PART_NAME: CAP; CDS_PHYS_PART_NAME: CAP_0402-A36096-112,EMPTY,0.1UF,25V,10%,LPDB,GENERIC; OriginalSymbolOrigin: (-25,50); XY: (7625,1775); VER: 2; ROT: 0; PHYS_PAGE: 57; LOCATION: C2L6; IP: GENERIC; FP_TECH: LPDB; DRAWING: @RVP1_ADL_SB_ADP_S_DDR5_SODIMM_2DPC_LIB.H55_DG2_2DPC(SCH_1):PAGE57; CDS_LIB: discrete; PCB Footprint: SMC0402IA; CDS_PART_NAME: CAP_0402-A36096-112,EMPTY,0.1UF,25V,10%,LPDB,GENERIC; CDS_LOCATION: C2L6
C5701 = CAP: PART_NUMBER: A36096-112; CDS_PHYS_PART_NAME: CAP_0402-A36096-112,X7R,0.1UF,25V,10%,LPDB,GENERIC; OriginalSymbolOrigin: (-50,25); XY: (3350,1075); VER: 1; ROT: 0; PHYS_PAGE: 57; LOCATION: C5701; DRAWING: @RVP1_ADL_SB_ADP_S_DDR5_SODIMM_2DPC_LIB.H55_DG2_2DPC(SCH_1):PAGE57; CDS_LIB: discrete; PCB Footprint: SMC0402IA; CHIPS_PART_NAME: CAP; CDS_PART_NAME: CAP_0402-A36096-112,X7R,0.1UF,25V,10%,LPDB,GENERIC; CDS_LOCATION: C5701; ASI_MODEL: A36096-112
C5702 = CAP: PART_NUMBER: A36096-112; CDS_PHYS_PART_NAME: CAP_0402-A36096-112,X7R,0.1UF,25V,10%,LPDB,GENERIC; OriginalSymbolOrigin: (-50,25); XY: (5425,1150); VER: 1; ROT: 0; PHYS_PAGE: 57; LOCATION: C5702; DRAWING: @RVP1_ADL_SB_ADP_S_DDR5_SODIMM_2DPC_LIB.H55_DG2_2DPC(SCH_1):PAGE57; CDS_LIB: discrete; PCB Footprint: SMC0402IA; CHIPS_PART_NAME: CAP; CDS_PART_NAME: CAP_0402-A36096-112,X7R,0.1UF,25V,10%,LPDB,GENERIC; CDS_LOCATION: C5702; ASI_MODEL: A36096-112
Q5701 = MOSFET_N_2: CDS_PHYS_PART_NAME: MOSFET_N_2_DFN-K22908-001,MFET,CSD15380F3,TK2,GENERIC; BOM_USE: STUFF; CDS_LMAN_SYM_OUTLINE: -200,200,200,-200; FP_TECH: TK2; IP: GENERIC; PACK_TYPE: DFN; ROOM: NONE; OriginalSymbolOrigin: (-125,125); XY: (3800,1900); VER: 1; ROT: 0; PHYS_PAGE: 57; LOCATION: Q5701; DRAWING: @RVP1_ADL_SB_ADP_S_DDR5_SODIMM_2DPC_LIB.H55_DG2_2DPC(SCH_1):PAGE57; CDS_LIB: discrete_2; VARIANT: ?; PCB Footprint: TK2_LCC3_730X640_350_MA; CHIPS_PART_NAME: MOSFET_N_2; CDS_PART_NAME: MOSFET_N_2_DFN-K22908-001,MFET,CSD15380F3,TK2,GENERIC; CDS_LOCATION: Q5701
R1L1 = RES: PART_NUMBER: A93548-034; CDS_PHYS_PART_NAME: RES_0402-A93548-034,EMPTY,10K,1%,1/16W,LPDB,GENERIC; WATTAGE: 1/16W; OriginalSymbolOrigin: (-25,75); XY: (6500,1075); VER: 2; PHYS_PAGE: 57; LOCATION: R1L1; IP: GENERIC; FP_TECH: LPDB; DRAWING: @RVP1_ADL_SB_ADP_S_DDR5_SODIMM_2DPC_LIB.H55_DG2_2DPC(SCH_1):PAGE57; CDS_LIB: discrete; PCB Footprint: SMR0402IA; ROT: 2; CHIPS_PART_NAME: RES; CDS_PART_NAME: RES_0402-A93548-034,EMPTY,10K,1%,1/16W,LPDB,GENERIC; CDS_LOCATION: R1L1; ASI_MODEL: A93548-034
R2B12 = RES#3: PART_NUMBER: A93549-027; CHIPS_PART_NAME: RES; CDS_PHYS_PART_NAME: RES_0402-A93549-027,EMPTY,100K,5%,1/16W,LPDB,GENERIC; WATTAGE: 1/16W; OriginalSymbolOrigin: (-25,75); XY: (4350,3700); VER: 4; ROT: 0; ROOM: DCL_CORE_GMCH; PHYS_PAGE: 57; LOCATION: R2B12; IP: GENERIC; FP_TECH: LPDB; FIN: EDP; DRAWING: @RVP1_ADL_SB_ADP_S_DDR5_SODIMM_2DPC_LIB.H55_DG2_2DPC(SCH_1):PAGE57; CDS_LIB: discrete; BOM: HDMI; PCB Footprint: SMR0402IA; CDS_PART_NAME: RES_0402-A93549-027,EMPTY,100K,5%,1/16W,LPDB,GENERIC; CDS_LOCATION: R2B12; ASI_MODEL: A93549-027
R2B13 = RES#3: PART_NUMBER: A93549-027; CHIPS_PART_NAME: RES; CDS_PHYS_PART_NAME: RES_0402-A93549-027,EMPTY,100K,5%,1/16W,LPDB,GENERIC; WATTAGE: 1/16W; OriginalSymbolOrigin: (-25,75); XY: (4350,3025); VER: 4; ROT: 0; ROOM: DCL_CORE_GMCH; PHYS_PAGE: 57; LOCATION: R2B13; IP: GENERIC; FP_TECH: LPDB; FIN: EDP; DRAWING: @RVP1_ADL_SB_ADP_S_DDR5_SODIMM_2DPC_LIB.H55_DG2_2DPC(SCH_1):PAGE57; CDS_LIB: discrete; BOM: HDMI; PCB Footprint: SMR0402IA; CDS_PART_NAME: RES_0402-A93549-027,EMPTY,100K,5%,1/16W,LPDB,GENERIC; CDS_LOCATION: R2B13; ASI_MODEL: A93549-027
R2B21 = RES: PART_NUMBER: A93548-226; CDS_PHYS_PART_NAME: RES_0402-A93548-226,EMPTY,499K,1%,1/16W,LPDB,GENERIC; WATTAGE: 1/16W; OriginalSymbolOrigin: (-25,75); XY: (3125,3050); VER: 2; ROT: 0; PHYS_PAGE: 57; LOCATION: R2B21; IP: GENERIC; FP_TECH: LPDB; DRAWING: @RVP1_ADL_SB_ADP_S_DDR5_SODIMM_2DPC_LIB.H55_DG2_2DPC(SCH_1):PAGE57; CDS_LIB: discrete; PCB Footprint: SMR0402IA; SEC_TYPE: 0402; CHIPS_PART_NAME: RES; CDS_PART_NAME: RES_0402-A93548-226,EMPTY,499K,1%,1/16W,LPDB,GENERIC; CDS_LOCATION: R2B21; ASI_MODEL: A93548-226
R2B22 = RES: CDS_PHYS_PART_NAME: RES_0402-A93548-226,EMPTY,499K,1%,1/16W,LPDB,GENERIC; WATTAGE: 1/16W; OriginalSymbolOrigin: (-25,75); XY: (3400,3050); VER: 2; ROT: 0; PHYS_PAGE: 57; LOCATION: R2B22; IP: GENERIC; FP_TECH: LPDB; DRAWING: @RVP1_ADL_SB_ADP_S_DDR5_SODIMM_2DPC_LIB.H55_DG2_2DPC(SCH_1):PAGE57; CDS_LIB: discrete; PCB Footprint: SMR0402IA; SEC_TYPE: 0402; CHIPS_PART_NAME: RES; CDS_PART_NAME: RES_0402-A93548-226,EMPTY,499K,1%,1/16W,LPDB,GENERIC; CDS_LOCATION: R2B22; ASI_MODEL: A93548-226
R2L3 = RES: CDS_PHYS_PART_NAME: RES_0402-A93549-027,CHIP,100K,5%,1/16W,LPDB,GENERIC; WATTAGE: 1/16W; OriginalSymbolOrigin: (-25,75); XY: (7800,675); VER: 2; ROT: 0; ROOM: DCL_CORE_GMCH; PHYS_PAGE: 57; LOCATION: R2L3; IP: GENERIC; FP_TECH: LPDB; FIN: EDP; DRAWING: @RVP1_ADL_SB_ADP_S_DDR5_SODIMM_2DPC_LIB.H55_DG2_2DPC(SCH_1):PAGE57; CDS_LIB: discrete; BOM: HDMI; PCB Footprint: SMR0402IA; CHIPS_PART_NAME: RES; CDS_PART_NAME: RES_0402-A93549-027,CHIP,100K,5%,1/16W,LPDB,GENERIC; CDS_LOCATION: R2L3; ASI_MODEL: A93549-027
R2L4 = RES: PART_NUMBER: A93549-023; CDS_PHYS_PART_NAME: RES_0402-A93549-023,CHIP,10K,5%,1/16W,LPDB,GENERIC; WATTAGE: 1/16W; OriginalSymbolOrigin: (-25,75); XY: (7450,675); VER: 2; ROT: 0; PHYS_PAGE: 57; LOCATION: R2L4; IP: GENERIC; FP_TECH: LPDB; DRAWING: @RVP1_ADL_SB_ADP_S_DDR5_SODIMM_2DPC_LIB.H55_DG2_2DPC(SCH_1):PAGE57; CDS_LIB: discrete; PCB Footprint: SMR0402IA; CHIPS_PART_NAME: RES; CDS_PART_NAME: RES_0402-A93549-023,CHIP,10K,5%,1/16W,LPDB,GENERIC; CDS_LOCATION: R2L4
R2L5 = RES#1: CHIPS_PART_NAME: RES; CDS_PHYS_PART_NAME: RES_0402-A93548-034,EMPTY,10K,1%,1/16W,LPDB,GENERIC; WATTAGE: 1/16W; OriginalSymbolOrigin: (-75,25); XY: (7000,1775); VER: 1; ROT: 2; PHYS_PAGE: 57; LOCATION: R2L5; IP: GENERIC; FP_TECH: LPDB; DRAWING: @RVP1_ADL_SB_ADP_S_DDR5_SODIMM_2DPC_LIB.H55_DG2_2DPC(SCH_1):PAGE57; CDS_LIB: discrete; PCB Footprint: SMR0402IA; CDS_PART_NAME: RES_0402-A93548-034,EMPTY,10K,1%,1/16W,LPDB,GENERIC; CDS_LOCATION: R2L5; ASI_MODEL: A93548-034
R2L6 = RES#1: PART_NUMBER: A93549-001; CHIPS_PART_NAME: RES; CDS_PHYS_PART_NAME: RES_0402-A93549-001,CHIP,0,5%,1/16W,LPDB,GENERIC; WATTAGE: 1/16W; OriginalSymbolOrigin: (-75,25); XY: (7025,1625); VER: 1; ROT: 2; PHYS_PAGE: 57; LOCATION: R2L6; IP: GENERIC; FP_TECH: LPDB; DRAWING: @RVP1_ADL_SB_ADP_S_DDR5_SODIMM_2DPC_LIB.H55_DG2_2DPC(SCH_1):PAGE57; CDS_LIB: discrete; PCB Footprint: SMR0402IA; CDS_PART_NAME: RES_0402-A93549-001,CHIP,0,5%,1/16W,LPDB,GENERIC; CDS_LOCATION: R2L6
R2L19 = RES#1: PART_NUMBER: A93549-001; CHIPS_PART_NAME: RES; CDS_PHYS_PART_NAME: RES_0402-A93549-001,EMPTY,0,5%,1/16W,LPDB,GENERIC; WATTAGE: 1/16W; OriginalSymbolOrigin: (-75,25); XY: (6825,1450); VER: 1; ROT: 2; PHYS_PAGE: 57; LOCATION: R2L19; IP: GENERIC; FP_TECH: LPDB; DRAWING: @RVP1_ADL_SB_ADP_S_DDR5_SODIMM_2DPC_LIB.H55_DG2_2DPC(SCH_1):PAGE57; CDS_LIB: discrete; PCB Footprint: SMR0402IA; CDS_PART_NAME: RES_0402-A93549-001,EMPTY,0,5%,1/16W,LPDB,GENERIC; CDS_LOCATION: R2L19
R2M32 = RES: CDS_PHYS_PART_NAME: RES_0402-A36092-310,EMPTY,500K,1%,1/16W,LPDB,GENERIC; WATTAGE: 1/16W; OriginalSymbolOrigin: (-25,75); XY: (4975,2150); VER: 2; ROT: 0; PHYS_PAGE: 57; LOCATION: R2M32; IP: GENERIC; FP_TECH: LPDB; DRAWING: @RVP1_ADL_SB_ADP_S_DDR5_SODIMM_2DPC_LIB.H55_DG2_2DPC(SCH_1):PAGE57; CDS_LIB: discrete; ASI_MODEL: A93548-226; PCB Footprint: SMR0402IA; SEC_TYPE: 0402; CHIPS_PART_NAME: RES; CDS_PART_NAME: RES_0402-A36092-310,EMPTY,500K,1%,1/16W,LPDB,GENERIC; CDS_LOCATION: R2M32
R2M33 = RES: CDS_PHYS_PART_NAME: RES_0402-A36092-310,EMPTY,500K,1%,1/16W,LPDB,GENERIC; WATTAGE: 1/16W; OriginalSymbolOrigin: (-25,75); XY: (5275,2150); VER: 2; ROT: 0; PHYS_PAGE: 57; LOCATION: R2M33; IP: GENERIC; FP_TECH: LPDB; DRAWING: @RVP1_ADL_SB_ADP_S_DDR5_SODIMM_2DPC_LIB.H55_DG2_2DPC(SCH_1):PAGE57; CDS_LIB: discrete; ASI_MODEL: A93548-226; PCB Footprint: SMR0402IA; SEC_TYPE: 0402; CHIPS_PART_NAME: RES; CDS_PART_NAME: RES_0402-A36092-310,EMPTY,500K,1%,1/16W,LPDB,GENERIC; CDS_LOCATION: R2M33
R5701 = RES#1: PART_NUMBER: A93549-001; CHIPS_PART_NAME: RES; CDS_PHYS_PART_NAME: RES_0402-A93549-001,CHIP,0,5%,1/16W,LPDB,GENERIC; WATTAGE: 1/16W; OriginalSymbolOrigin: (-75,25); XY: (3075,1800); VER: 1; PHYS_PAGE: 57; LOCATION: R5701; IP: GENERIC; FP_TECH: LPDB; DRAWING: @RVP1_ADL_SB_ADP_S_DDR5_SODIMM_2DPC_LIB.H55_DG2_2DPC(SCH_1):PAGE57; CDS_LIB: discrete; PCB Footprint: SMR0402IA; SEC_TYPE: 0402; ROT: 0; CDS_PART_NAME: RES_0402-A93549-001,CHIP,0,5%,1/16W,LPDB,GENERIC; CDS_LOCATION: R5701; ASI_MODEL: A93549-001
R5705 = RES: CDS_PHYS_PART_NAME: RES_0201-H74132-007,RES,1K,1%,1/20W,LPDB,GENERIC; OriginalSymbolOrigin: (-25,75); XY: (3850,2425); VER: 2; ROT: 0; PHYS_PAGE: 57; LOCATION: R5705; IP: GENERIC; FP_TECH: LPDB; DRAWING: @RVP1_ADL_SB_ADP_S_DDR5_SODIMM_2DPC_LIB.H55_DG2_2DPC(SCH_1):PAGE57; CDS_LIB: discrete; MATERIAL: RES; PCB Footprint: SMR0201IA; CHIPS_PART_NAME: RES; CDS_PART_NAME: RES_0201-H74132-007,RES,1K,1%,1/20W,LPDB,GENERIC; CDS_LOCATION: R5705
R5706 = RES#1: CHIPS_PART_NAME: RES; CDS_PHYS_PART_NAME: RES_0402-A93548-034,EMPTY,10K,1%,1/16W,LPDB,GENERIC; WATTAGE: 1/16W; OriginalSymbolOrigin: (-75,25); XY: (7625,2000); VER: 1; ROT: 2; PHYS_PAGE: 57; LOCATION: R5706; IP: GENERIC; FP_TECH: LPDB; DRAWING: @RVP1_ADL_SB_ADP_S_DDR5_SODIMM_2DPC_LIB.H55_DG2_2DPC(SCH_1):PAGE57; CDS_LIB: discrete; PCB Footprint: SMR0402IA; CDS_PART_NAME: RES_0402-A93548-034,EMPTY,10K,1%,1/16W,LPDB,GENERIC; CDS_LOCATION: R5706; ASI_MODEL: A93548-034
U5701 = C_SN74CBTLV3257: CDS_PHYS_PART_NAME: C_SN74CBTLV3257_SSOP-M78347-001,IC,SN74CBTLV3257DBQR,TK2,GENERIC; CDS_LMAN_SYM_OUTLINE: -200,450,200,-450; FP_TECH: TK2; IP: GENERIC; PACK_TYPE: SSOP; ROOM: NONE; OriginalSymbolOrigin: (-250,450); XY: (8150,1275); VER: 1; ROT: 0; PHYS_PAGE: 57; LOCATION: U5701; DRAWING: @RVP1_ADL_SB_ADP_S_DDR5_SODIMM_2DPC_LIB.H55_DG2_2DPC(SCH_1):PAGE57; CDS_LIB: local; VARIANT: ?; PCB Footprint: CTK2_SSOP16_3980X5000_635_MA; SEC_TYPE: SSOP; CHIPS_PART_NAME: C_SN74CBTLV3257; CDS_PART_NAME: C_SN74CBTLV3257_SSOP-M78347-001,IC,SN74CBTLV3257DBQR,TK2,GENERIC; CDS_LOCATION: U5701
U5702 = C_TTL1G97: CDS_PHYS_PART_NAME: C_TTL1G97_LCC-G84640-001,IC,SN74AUP1G97DSFR,TK2,GENERIC; CDS_LMAN_SYM_OUTLINE: -200,200,200,-200; FP_TECH: TK2; IP: GENERIC; PACK_TYPE: LCC; ROOM: NONE; OriginalSymbolOrigin: (-225,200); XY: (2825,800); VER: 1; ROT: 0; PHYS_PAGE: 57; LOCATION: U5702; DRAWING: @RVP1_ADL_SB_ADP_S_DDR5_SODIMM_2DPC_LIB.H55_DG2_2DPC(SCH_1):PAGE57; CDS_LIB: local; VARIANT: ?; PCB Footprint: CTK2_LCC6_S1050_350_MA_MR; CHIPS_PART_NAME: C_TTL1G97; CDS_PART_NAME: C_TTL1G97_LCC-G84640-001,IC,SN74AUP1G97DSFR,TK2,GENERIC; CDS_LOCATION: U5702
U5703 = C_TTL1G97: CDS_PHYS_PART_NAME: C_TTL1G97_LCC-G84640-001,IC,SN74AUP1G97DSFR,TK2,GENERIC; CDS_LMAN_SYM_OUTLINE: -200,200,200,-200; FP_TECH: TK2; IP: GENERIC; PACK_TYPE: LCC; ROOM: NONE; OriginalSymbolOrigin: (-225,200); XY: (4900,875); VER: 1; ROT: 0; PHYS_PAGE: 57; LOCATION: U5703; DRAWING: @RVP1_ADL_SB_ADP_S_DDR5_SODIMM_2DPC_LIB.H55_DG2_2DPC(SCH_1):PAGE57; CDS_LIB: local; VARIANT: ?; PCB Footprint: CTK2_LCC6_S1050_350_MA_MR; CHIPS_PART_NAME: C_TTL1G97; CDS_PART_NAME: C_TTL1G97_LCC-G84640-001,IC,SN74AUP1G97DSFR,TK2,GENERIC; CDS_LOCATION: U5703